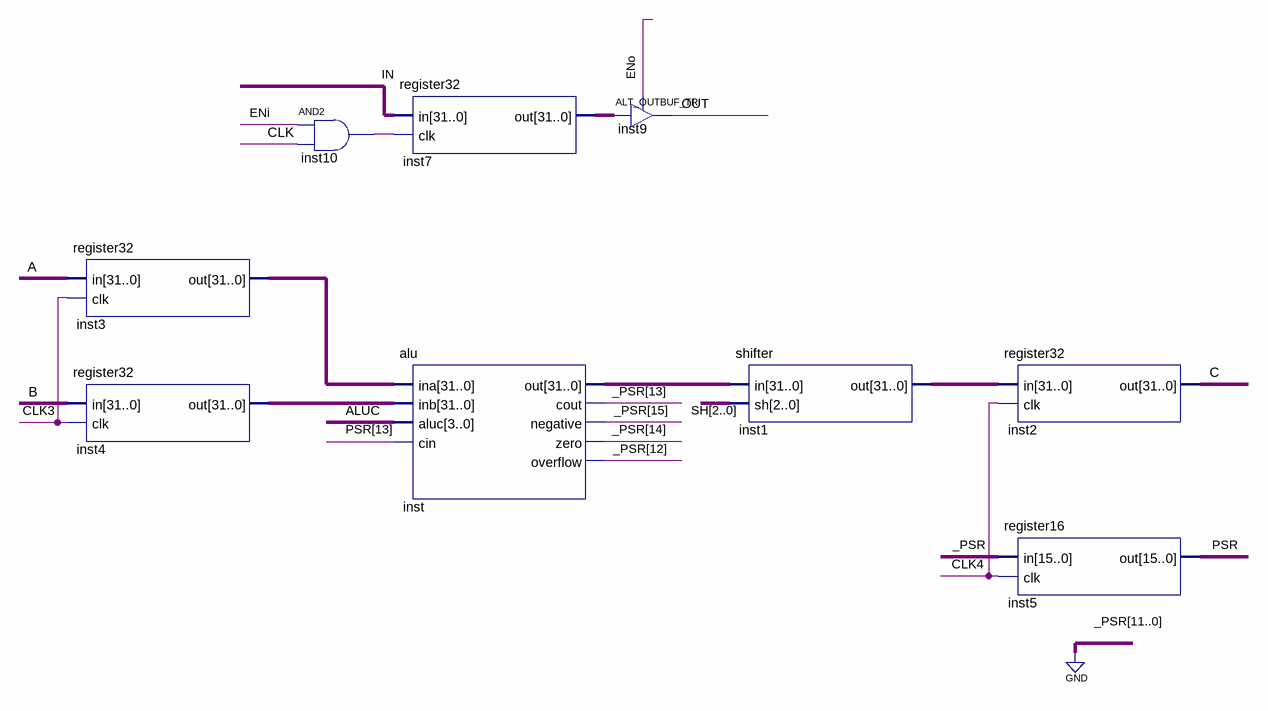
[diagram p0: schematic sheet]
// Quartus schematic ev21g1.bdf as structural Verilog: 9 symbols, 0 pins
module ev21g1 (
);

  wire _PSR_1bit, A, ALUC, B, C, CLK, CLK3, CLK4, ENi, ENo, IN, inst10_out, OUT, PSR_1bit;
  wire [2:0] SH;
  wire [13:13] PSR;
  wire [15:12] _PSR;
  wire [31:0] inst1_out, inst3_out, inst4_out, inst7_out, inst_out;

  register32 inst3 (.in({32{A}}), .clk(CLK3), .out(inst3_out));
  register32 inst4 (.in({32{B}}), .clk(CLK3), .out(inst4_out));
  and inst10 (inst10_out, ENi, CLK);
  register32 inst7 (.in({32{IN}}), .clk(inst10_out), .out(inst7_out));
  alu inst (
    .ina(inst3_out), .inb(inst4_out), .aluc({4{ALUC}}), .cin(PSR[13]), .out(inst_out), .cout(_PSR[13]),
    .negative(_PSR[15]), .zero(_PSR[14]), .overflow(_PSR[12]));
  ALT_OUTBUF_TRI inst9[31:0] (.i(inst7_out), .oe(ENo), .o(OUT));
  shifter inst1 (.in(inst_out), .sh(SH), .out(inst1_out));
  register32 inst2 (.in(inst1_out), .clk(CLK4), .out(C));
  register16 inst5 (.in({16{_PSR_1bit}}), .clk(CLK4), .out(PSR_1bit));
endmodule
